# EAGLE design Aux_Power_Board (EAGLE 9.0.1)

## Sheet 1 of 3
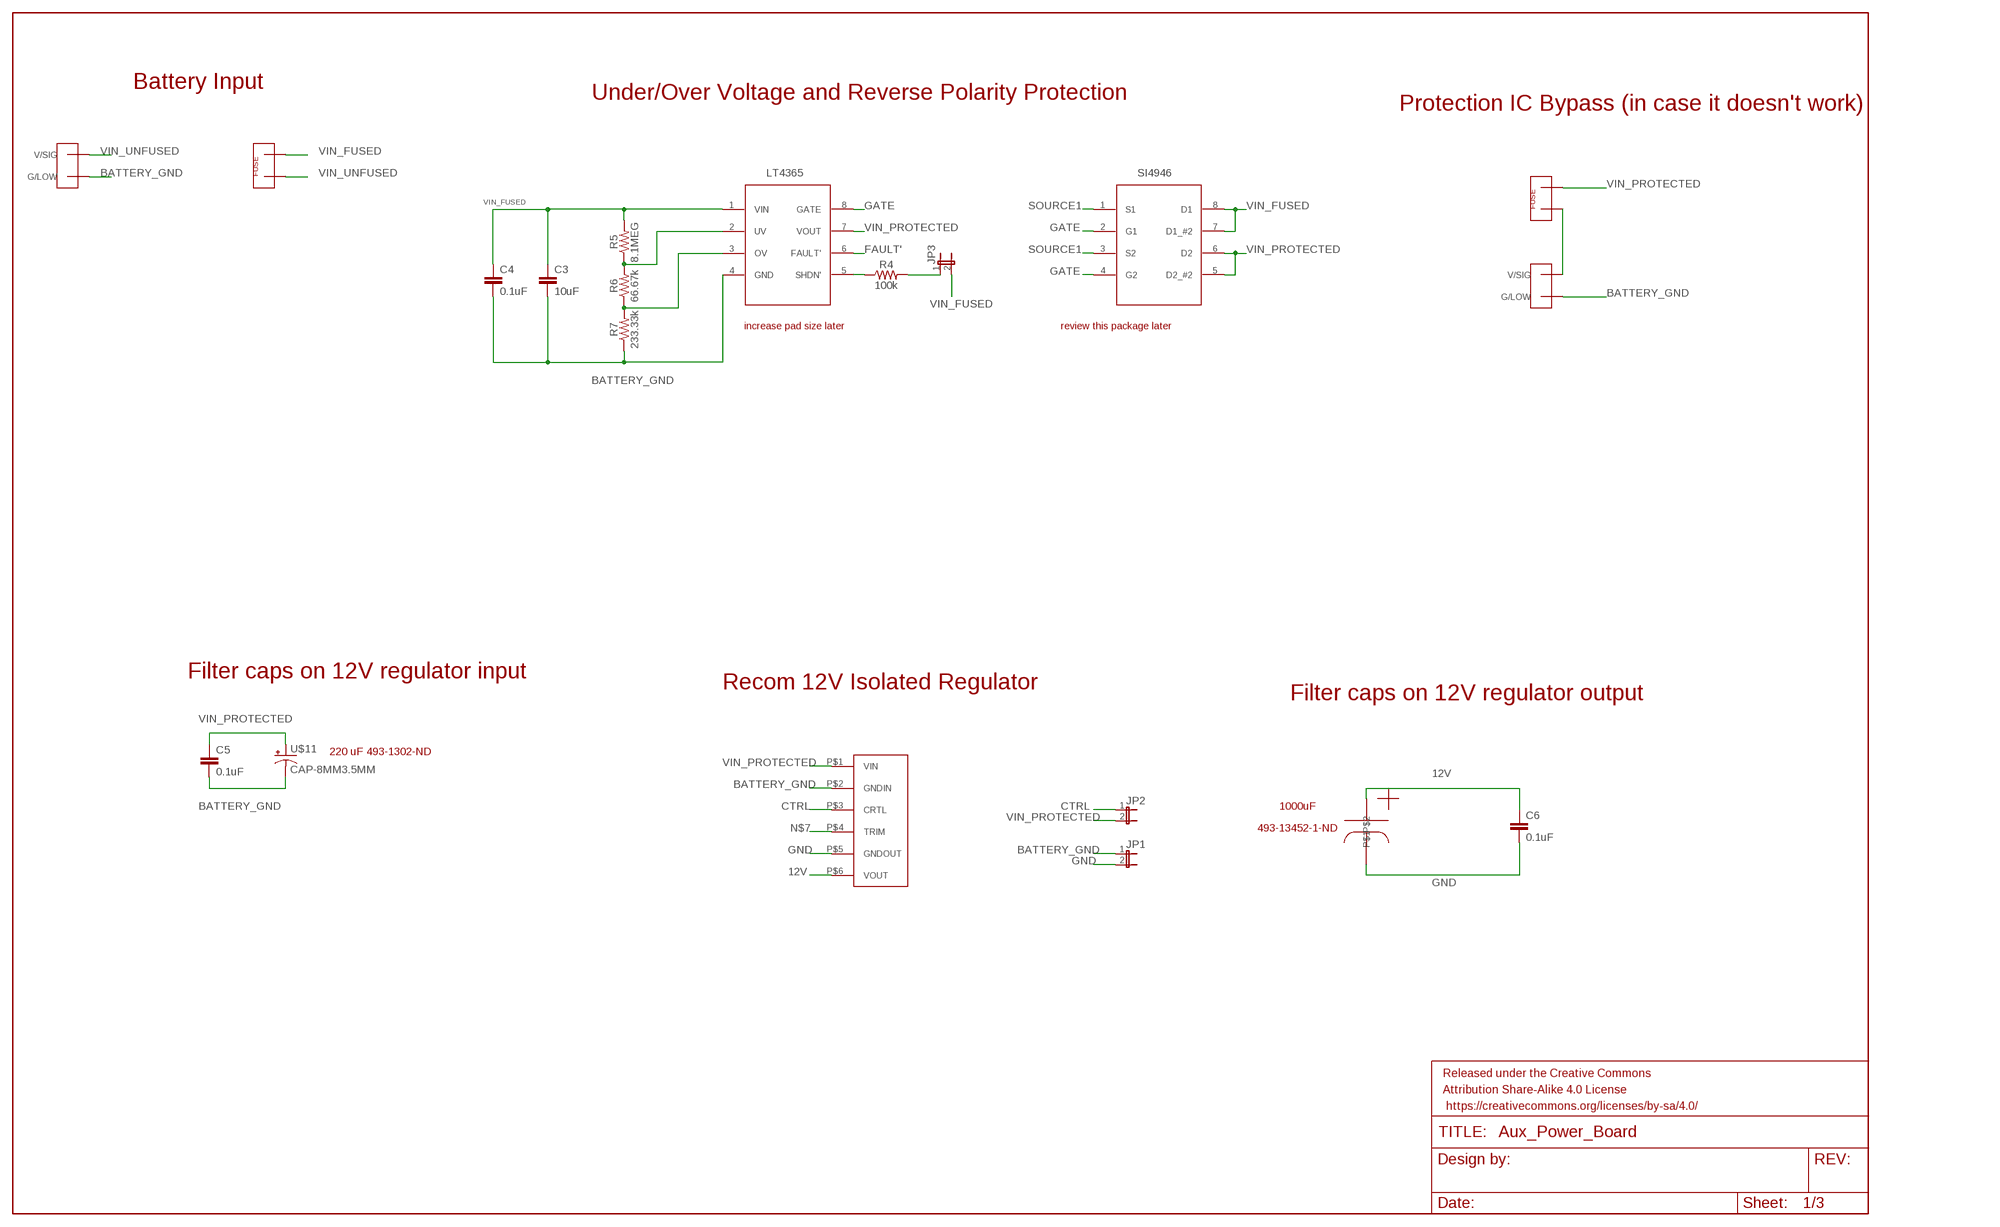
[diagram p0: schematic, sheet 1]

### Parts
C3  10uF  1.0UF-0805-25V-10%  [0805]
C4  0.1uF  1.0UF-0805-25V-10%  [0805]
C5  0.1uF  1.0UF-0805-25V-10%  [0805]
C6  0.1uF  1.0UF-0805-25V-10%  [0805]
FRAME2  FRAME-LEDGER  [CREATIVE_COMMONS]
JP1  JP1E  [JP1]
JP2  JP1E  [JP1]
JP3  JP1E  [JP1]
R4  100k  0.22OHM-0805-1/4W-1%  [0805]
R5  8.1MEG  0.22OHM-0805-1/4W-1%  [0805]
R6  66.67k  0.22OHM-0805-1/4W-1%  [0805]
R7  233.33k  0.22OHM-0805-1/4W-1%  [0805]
U$5  LT4365  [TSOT-23_TS8]
U$6  SI4946  [SOIC127P600X175-8N]
U$11  CAP-8MM3.5MM  [CAP-8MM*3.5MM]
U$12  RPA60-2412SFW_P  [RPA60-2412SFW/P]
U$13  FUSEMINI-BLADE  [MINI-BLADE-FUSE]
U$14  TE770966  [2X1-MATE-N-LOCK]
U$20  FUSEMINI-BLADE  [MINI-BLADE-FUSE]
U$21  TE770966  [2X1-MATE-N-LOCK]
U$22  CAPESK108M025AH4EA  [ESK108M025AH4EA]

### Nets
12V: C6.1 U$12.P$6(VOUT) U$22.P$1 ; also sheet 2,3
BATTERY_GND: C3.2 C4.2 C5.2 JP1.1 R7.1 U$5.4(GND) U$11.P$2(-) U$12.P$2(GNDIN) U$14.CIRCUIT2(G/LOW) U$21.CIRCUIT2(G/LOW) ; also sheet 2
CTRL: JP2.1 U$12.P$3(CRTL)
FAULT': U$5.6(FAULT') ; also sheet 2
GATE: U$5.8(GATE) U$6.2(G1) U$6.4(G2)
GND: C6.2 JP1.2 U$12.P$5(GNDOUT) U$22.P$2 ; also sheet 2,3
N$2: R4.1 U$5.5(SHDN')
N$4: R5.1 R6.2 U$5.2(UV)
N$5: R6.1 R7.2 U$5.3(OV)
N$7: U$12.P$4(TRIM)
N$13: JP3.1 R4.2
N$14: U$20.IN U$21.CIRCUIT1(V/SIG)
SOURCE1: U$6.1(S1) U$6.3(S2)
VIN_FUSED: C3.1 C4.1 JP3.2 R5.2 U$5.1(VIN) U$6.7(D1_#2) U$6.8(D1) U$13.OUT ; also sheet 2
VIN_PROTECTED: C5.1 JP2.2 U$5.7(VOUT) U$6.5(D2_#2) U$6.6(D2) U$11.P$1(+) U$12.P$1(VIN) U$20.OUT ; also sheet 3
VIN_UNFUSED: U$13.IN U$14.CIRCUIT1(V/SIG)

### Notes on the sheet
- Battery Input
- Under/Over Voltage and Reverse Polarity Protection
- Protection IC Bypass (in case it doesn't work)
- increase pad size later | review this package later
- Filter caps on 12V regulator input
- Recom 12V Isolated Regulator
- Filter caps on 12V regulator output
- 220 uF 493-1302-ND
- 1000uF
- 493-13452-1-ND

## Sheet 2 of 3
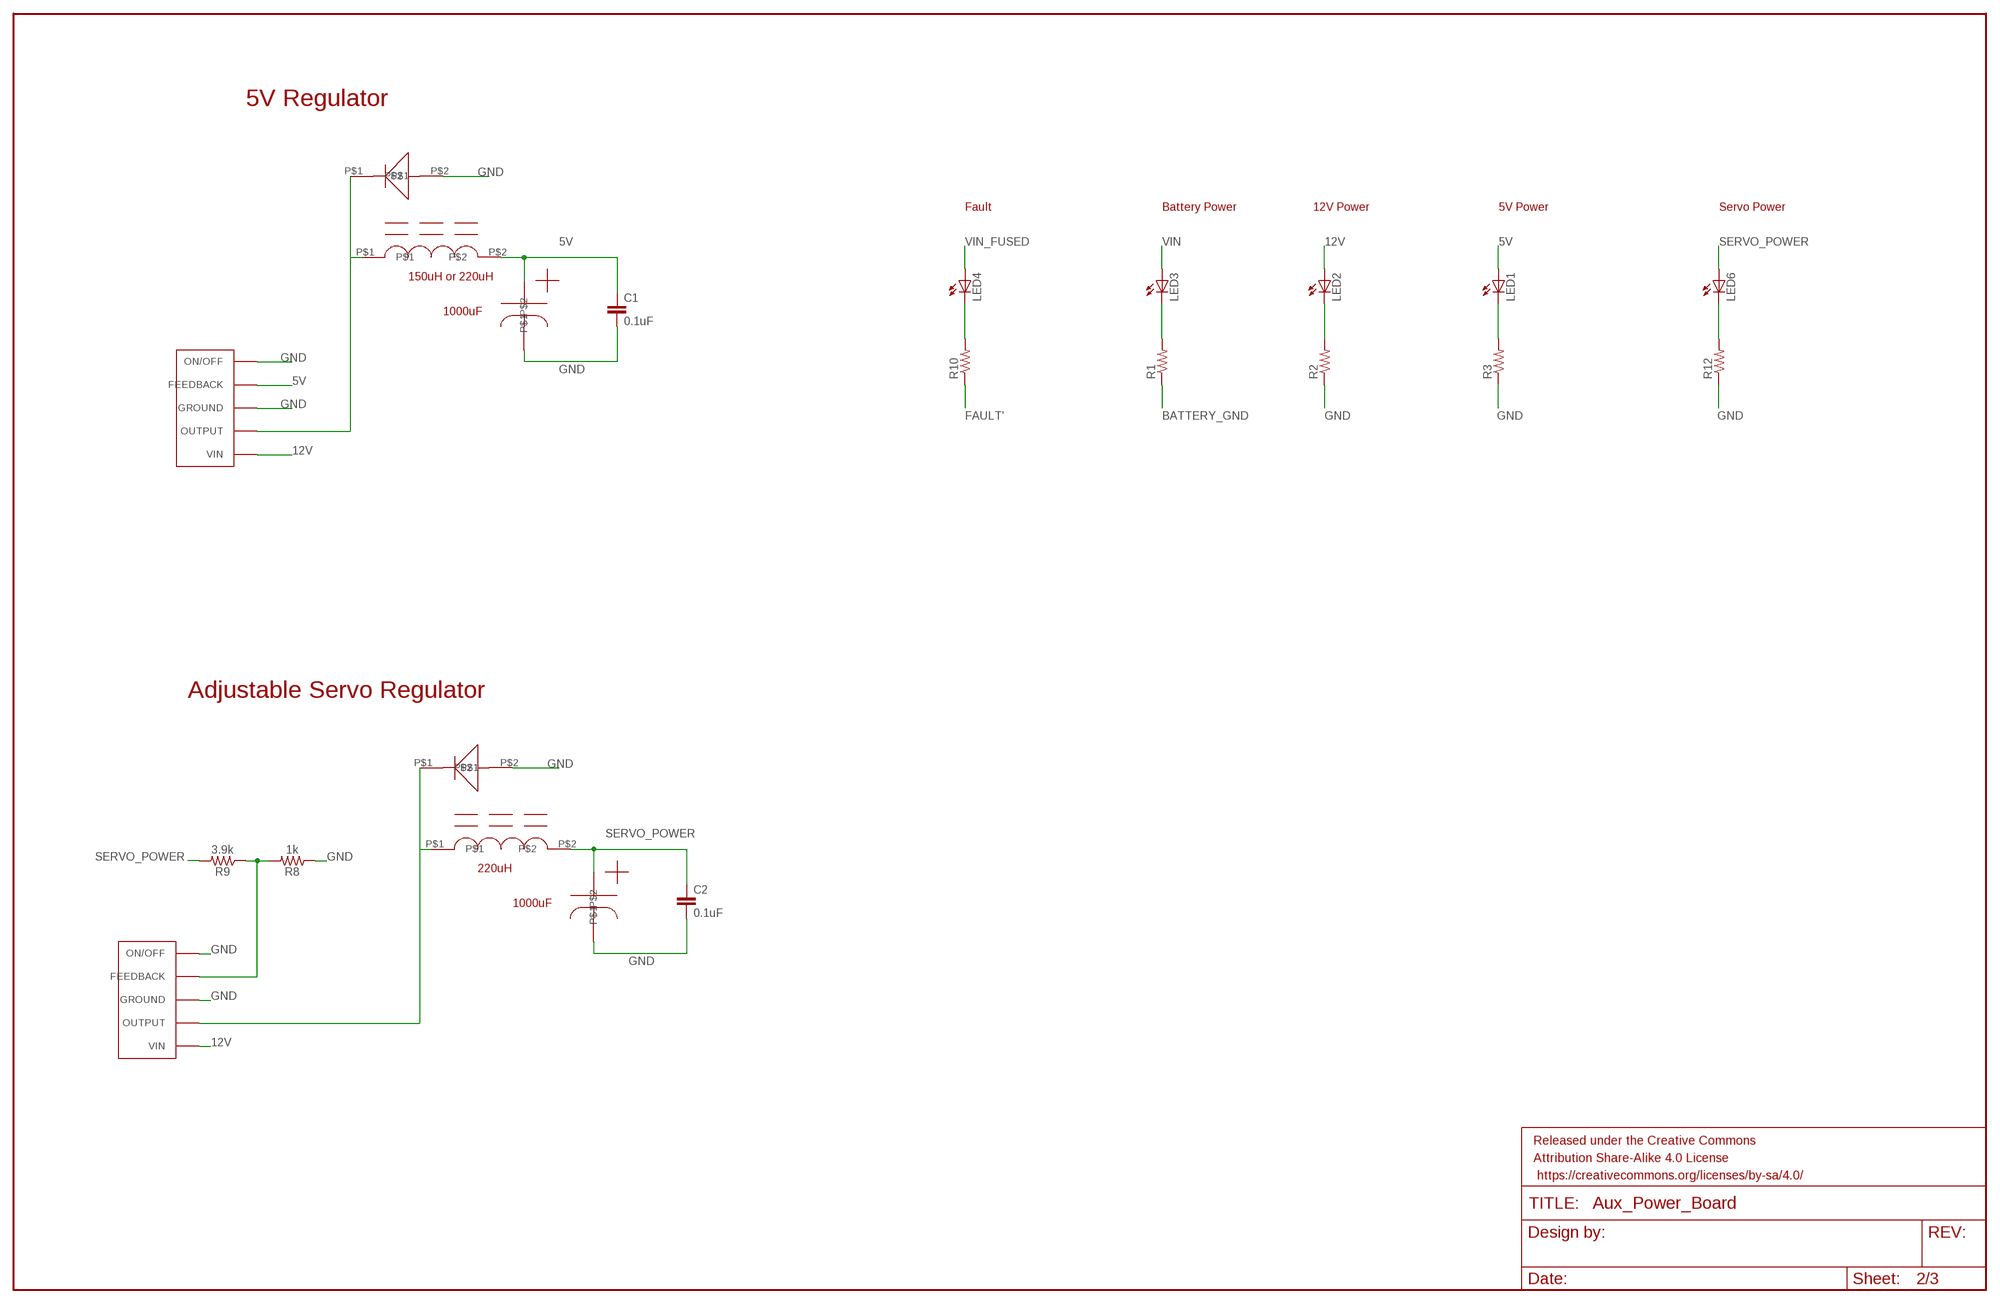
[diagram p1: schematic, sheet 2]

### Parts
C1  0.1uF  1.0UF-0805-25V-10%  [0805]
C2  0.1uF  1.0UF-0805-25V-10%  [0805]
FRAME1  FRAME-LEDGER  [CREATIVE_COMMONS]
LED1  LEDCHIP-LED0805  [CHIP-LED0805]
LED2  LEDCHIP-LED0805  [CHIP-LED0805]
LED3  LEDCHIP-LED0805  [CHIP-LED0805]
LED4  LEDCHIP-LED0805  [CHIP-LED0805]
LED6  LEDCHIP-LED0805  [CHIP-LED0805]
R1  R-US_M0805  [M0805]
R2  R-US_M0805  [M0805]
R3  R-US_M0805  [M0805]
R8  1k  0.22OHM-0805-1/4W-1%  [0805]
R9  3.9k  0.22OHM-0805-1/4W-1%  [0805]
R10  R-US_M0805  [M0805]
R12  R-US_M0805  [M0805]
U$4  MBR360GOS  [MBR360GOS]
U$7  LM2576  [D2PAK-5]
U$8  MBR360GOS  [MBR360GOS]
U$9  CAPESK108M025AH4EA  [ESK108M025AH4EA]
U$10  M1418-ND  [M1418-ND]
U$23  LM2576  [D2PAK-5]
U$24  CAPESK108M025AH4EA  [ESK108M025AH4EA]
U$25  M1418-ND  [M1418-ND]

### Nets
5V: C1.1 LED1.A U$7.4(FEEDBACK) U$9.P$1 U$10.P$2 ; also sheet 3
12V: LED2.A U$7.1(VIN) U$23.1(VIN) ; also sheet 1,3
BATTERY_GND: R1.1 ; also sheet 1
FAULT': R10.1 ; also sheet 1
GND: C1.2 C2.2 R2.1 R3.1 R8.1 R12.1 U$4.P$2 U$7.3(GROUND) U$7.5(ON/OFF) U$7.GROUND U$8.P$2 U$9.P$2 U$23.3(GROUND) U$23.5(ON/OFF) U$23.GROUND U$24.P$2 ; also sheet 1,3
N$1: U$4.P$1 U$7.2(OUTPUT) U$10.P$1
N$3: LED3.C R1.2
N$6: LED2.C R2.2
N$9: LED1.C R3.2
N$15: U$8.P$1 U$23.2(OUTPUT) U$25.P$1
N$16: R8.2 R9.1 U$23.4(FEEDBACK)
N$17: LED4.C R10.2
N$19: LED6.C R12.2
SERVO_POWER: C2.1 LED6.A R9.2 U$24.P$1 U$25.P$2 ; also sheet 3
VIN: LED3.A
VIN_FUSED: LED4.A ; also sheet 1

### Notes on the sheet
- 5V Regulator
- Fault | Battery Power | 12V Power | 5V Power | Servo Power
- 150uH or 220uH
- 1000uF
- Adjustable Servo Regulator
- 220uH
- 1000uF

## Sheet 3 of 3
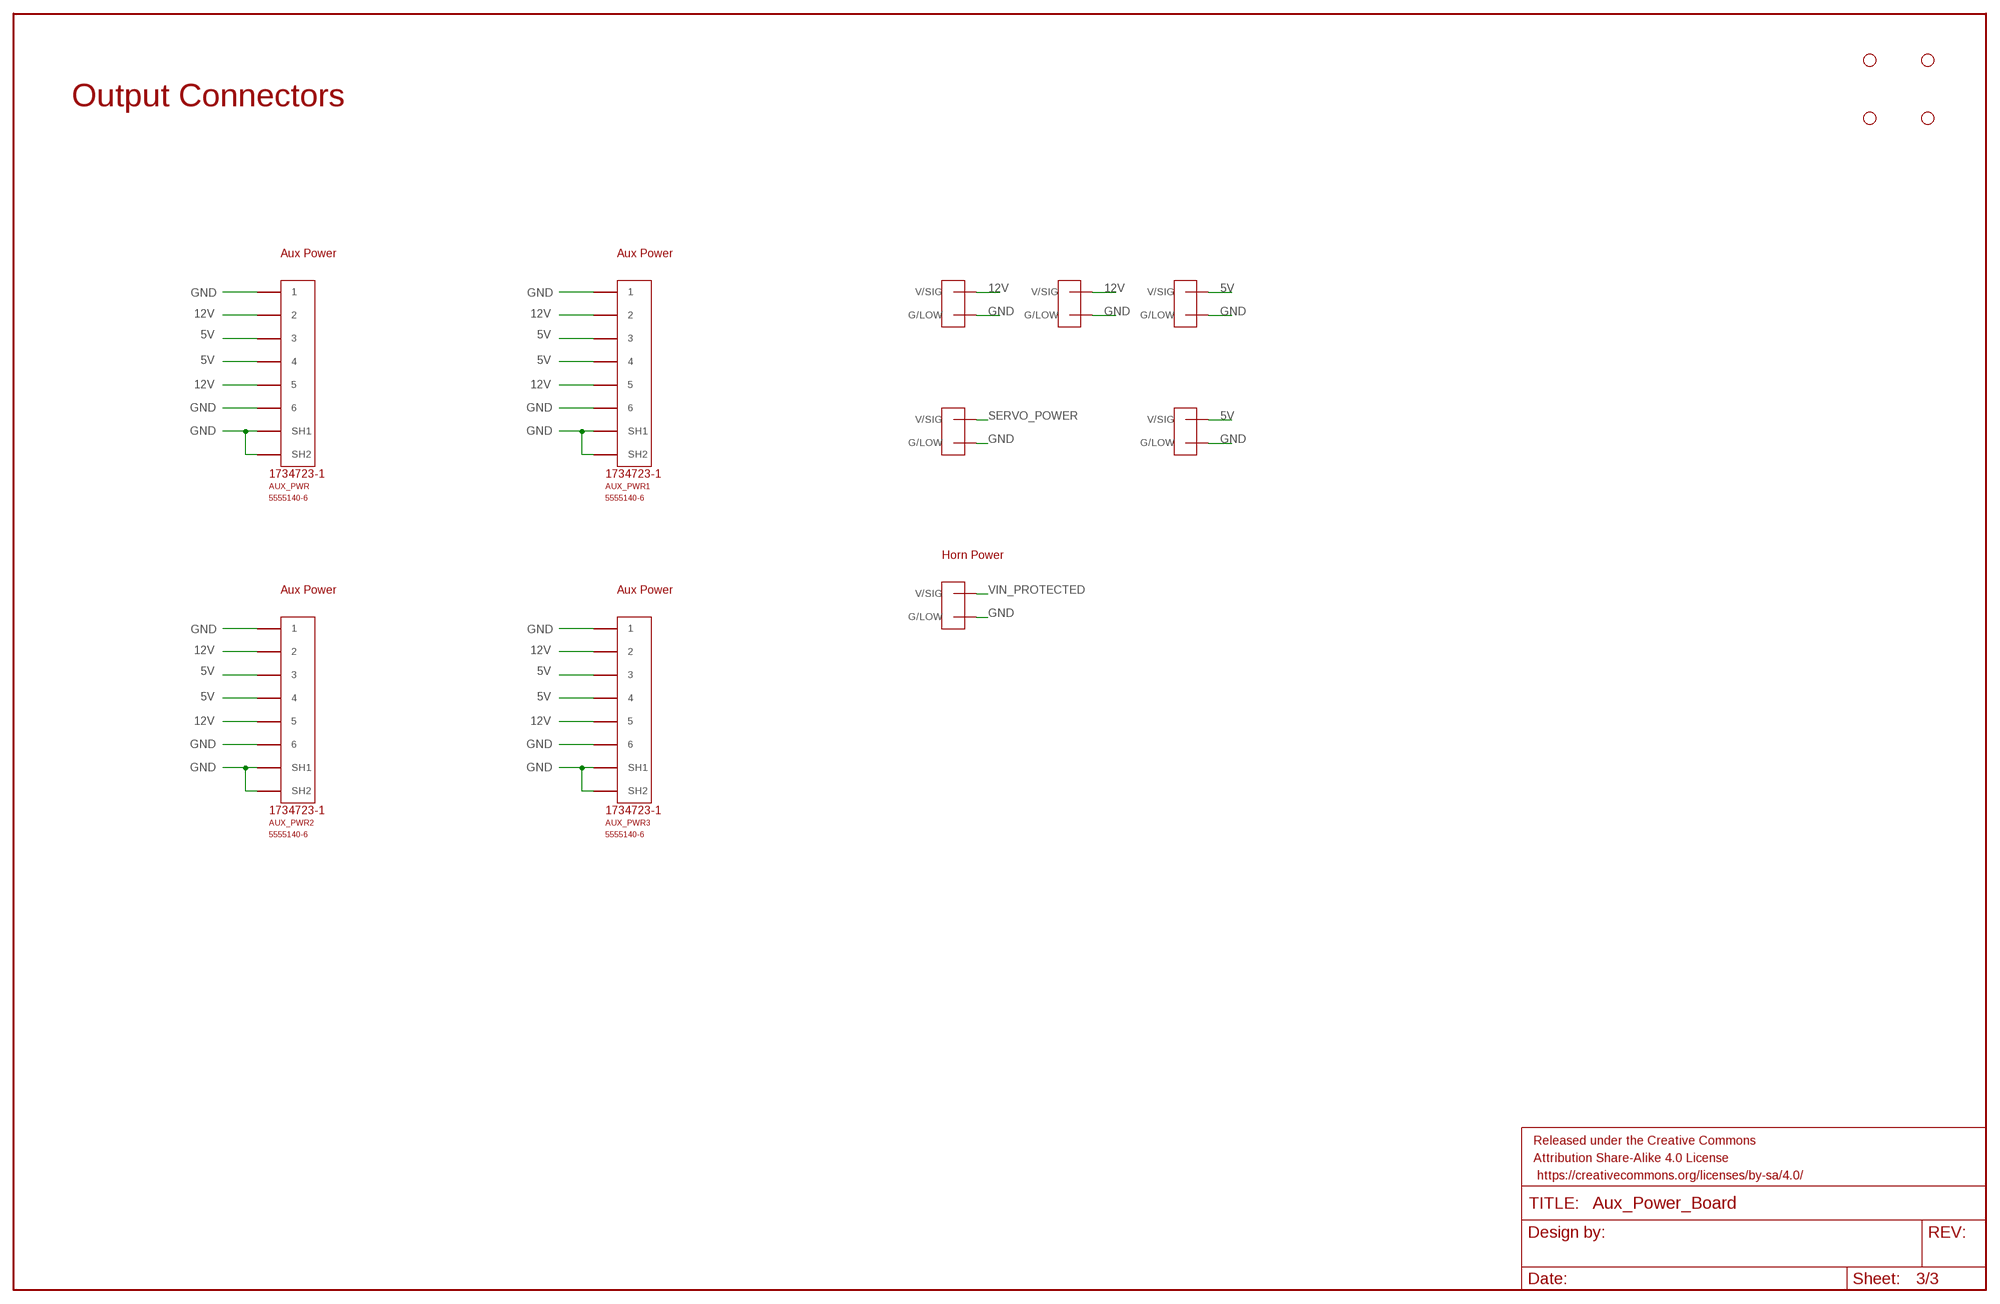
[diagram p2: schematic, sheet 3]

### Parts
AUX_PWR  5555140-6  [1734723-1_RJ11]
AUX_PWR1  5555140-6  [1734723-1_RJ11]
AUX_PWR2  5555140-6  [1734723-1_RJ11]
AUX_PWR3  5555140-6  [1734723-1_RJ11]
FRAME4  FRAME-LEDGER  [CREATIVE_COMMONS]
H1  STAND-OFF  [STAND-OFF]
H2  STAND-OFF  [STAND-OFF]
H3  STAND-OFF  [STAND-OFF]
H4  STAND-OFF  [STAND-OFF]
U$1  TE770966  [2X1-MATE-N-LOCK]
U$2  TE770966  [2X1-MATE-N-LOCK]
U$3  TE770966  [2X1-MATE-N-LOCK]
U$15  TE770966  [2X1-MATE-N-LOCK]
U$26  TE770966  [2X1-MATE-N-LOCK]
U$27  TE770966  [2X1-MATE-N-LOCK]

### Nets
5V: AUX_PWR1.3 AUX_PWR1.4 AUX_PWR2.3 AUX_PWR2.4 AUX_PWR3.3 AUX_PWR3.4 AUX_PWR.3 AUX_PWR.4 U$3.CIRCUIT1(V/SIG) U$27.CIRCUIT1(V/SIG) ; also sheet 2
12V: AUX_PWR1.2 AUX_PWR1.5 AUX_PWR2.2 AUX_PWR2.5 AUX_PWR3.2 AUX_PWR3.5 AUX_PWR.2 AUX_PWR.5 U$1.CIRCUIT1(V/SIG) U$2.CIRCUIT1(V/SIG) ; also sheet 1,2
GND: AUX_PWR1.1 AUX_PWR1.6 AUX_PWR1.SH1 AUX_PWR1.SH2 AUX_PWR2.1 AUX_PWR2.6 AUX_PWR2.SH1 AUX_PWR2.SH2 AUX_PWR3.1 AUX_PWR3.6 AUX_PWR3.SH1 AUX_PWR3.SH2 AUX_PWR.1 AUX_PWR.6 AUX_PWR.SH1 AUX_PWR.SH2 U$1.CIRCUIT2(G/LOW) U$2.CIRCUIT2(G/LOW) U$3.CIRCUIT2(G/LOW) U$15.CIRCUIT2(G/LOW) U$26.CIRCUIT2(G/LOW) U$27.CIRCUIT2(G/LOW) ; also sheet 1,2
SERVO_POWER: U$26.CIRCUIT1(V/SIG) ; also sheet 2
VIN_PROTECTED: U$15.CIRCUIT1(V/SIG) ; also sheet 1

### Notes on the sheet
- Output Connectors
- Aux Power | Aux Power
- Horn Power
- Aux Power | Aux Power

## Library data of the parts
AUX_PWR AUX_PWR1-AUX_PWR3 = 5555140-6 RJ11:5555140-6
C1-C6 = SparkFun-Capacitors:1.0UF: 1µF ceramic capacitors A capacitor is a passive two-terminal electrical component used to store electrical energy temporarily in an electric field.; PROD_ID: CAP-08064; VALUE: 1.0uF
FRAME1 FRAME2 FRAME4 = SparkFun-Aesthetics:FRAME-LEDGER: Schematic Frame - Ledger Standard 11x14 US Ledger frame
H1-H4 = SparkFun-Electromechanical:STAND-OFF: #4 Stand Off This is the mechanical footprint for a #4 phillips button head screw. Use the keepout ring to avoid running the screw head into surrounding components. SKU : PRT-00447
JP1-JP3 = jumper:JP1E: JUMPER
LED1-LED4 LED6 = led:LED: LED OSRAM: - CHIPLED LG R971, LG N971, LY N971, LG Q971, LY Q971, LO R971, LY R971 LH N974, LH R974 LS Q976, LO Q976, LY Q976 LO Q996 - Hyper CHIPLED LW Q18S LB Q993, LB Q99A, LB R99A - SideLED LS A670, LO A670, LY A670, LG A670, LP A670 LB A673, LV A673, LT A673, LW A673 LH A674 LY A675 LS A676, LA A676, LO A676, LY A676, LW A676 LS A679, LY A679, LG A679 - Hyper Micro SIDELED® LS Y876, LA Y876, LO Y876, LY Y876 LT Y87S - SmartLED LW L88C, LW L88S LB L89C, LB L89S, LG L890 LS L89K, LO L89K, LY L89K LS L896, LA L896, LO L896, LY L896 - TOPLED LS T670, LO T670, LY T670, LG T670, LP T670 LSG T670, LSP T670, LSY T670, LOP T670, LYG T670 LG T671, LOG T671, LSG T671 LB T673, LV T673, LT T673, LW T673 LH T674 LS T676, LA T676, LO T676, LY T676, LB T676, LH T676, LSB T676, LW T676 LB T67C, LV T67C, LT T67C, LS T67K, LO T67K, LY T67K, LW E67C LS E67B, LA E67B, LO E67B, LY E67B, LB E67C, LV E67C, LT E67C LW T67C LS T679, LY T679, LG T679 LS T770, LO T770, LY T770, LG T770, LP T770 LB T773, LV T773, LT T773, LW T773 LH T774 LS E675, LA E675, LY E675, LS T675 LS T776, LA T776, LO T776, LY T776, LB T776 LHGB T686 LT T68C, LB T68C - Hyper Mini TOPLED® LB M676 - Mini TOPLED Santana® LG M470 LS M47K, LO M47K, LY M47K Source: http://www.osram.convergy.de LUXEON: - LUMILED® LXK2-PW12-R00, LXK2-PW12-S00, LXK2-PW14-U00, LXK2-PW14-V00 LXK2-PM12-R00, LXK2-PM12-S00, LXK2-PM14-U00 LXK2-PE12-Q00, LXK2-PE12-R00, LXK2-PE12-S00, LXK2-PE14-T00, LXK2-PE14-U00 LXK2-PB12-K00, LXK2-PB12-L00, LXK2-PB12-M00, LXK2-PB14-N00, LXK2-PB14-P00, LXK2-PB14-Q00 LXK2-PR12-L00, LXK2-PR12-M00, LXK2-PR14-Q00, LXK2-PR14-R00 LXK2-PD12-Q00, LXK2-PD12-R00, LXK2-PD12-S00 LXK2-PH12-R00, LXK2-PH12-S00 LXK2-PL12-P00, LXK2-PL12-Q00, LXK2-PL12-R00 Source: www.luxeon.com KINGBRIGHT: KA-3528ASYC Source: www.kingbright.com
R1-R3 R10 R12 = rcl:R-US_: RESISTOR, American symbol; SPICEPREFIX: R
R4-R9 = SparkFun-Resistors:0.22OHM: 0.22Ω resistor A resistor is a passive two-terminal electrical component that implements electrical resistance as a circuit element. Resistors act to reduce current flow, and, at the same time, act to lower voltage levels within circuits. - Wikipedia; PROD_ID: RES-09883; VALUE: 0.22
U$1-U$3 U$14 U$15 U$21 U$26 U$27 = Shell2013(1):TE770966
U$4 U$8 = Shell2013:MBR360GOS
U$5 = Eagle Library:LT4365
U$6 = Eagle Library:SI4946
U$7 U$23 = Shell2015:LM2576
U$9 U$22 U$24 = Shell2015:CAP
U$10 U$25 = Shell2015:M1418-ND: 100uF inductor
U$11 = Eagle Library:CAP-8MM*3.5MM
U$12 = RPA60-2412SFW_P:RPA60-2412SFW_P
U$13 U$20 = Shell2013:FUSE

## Board
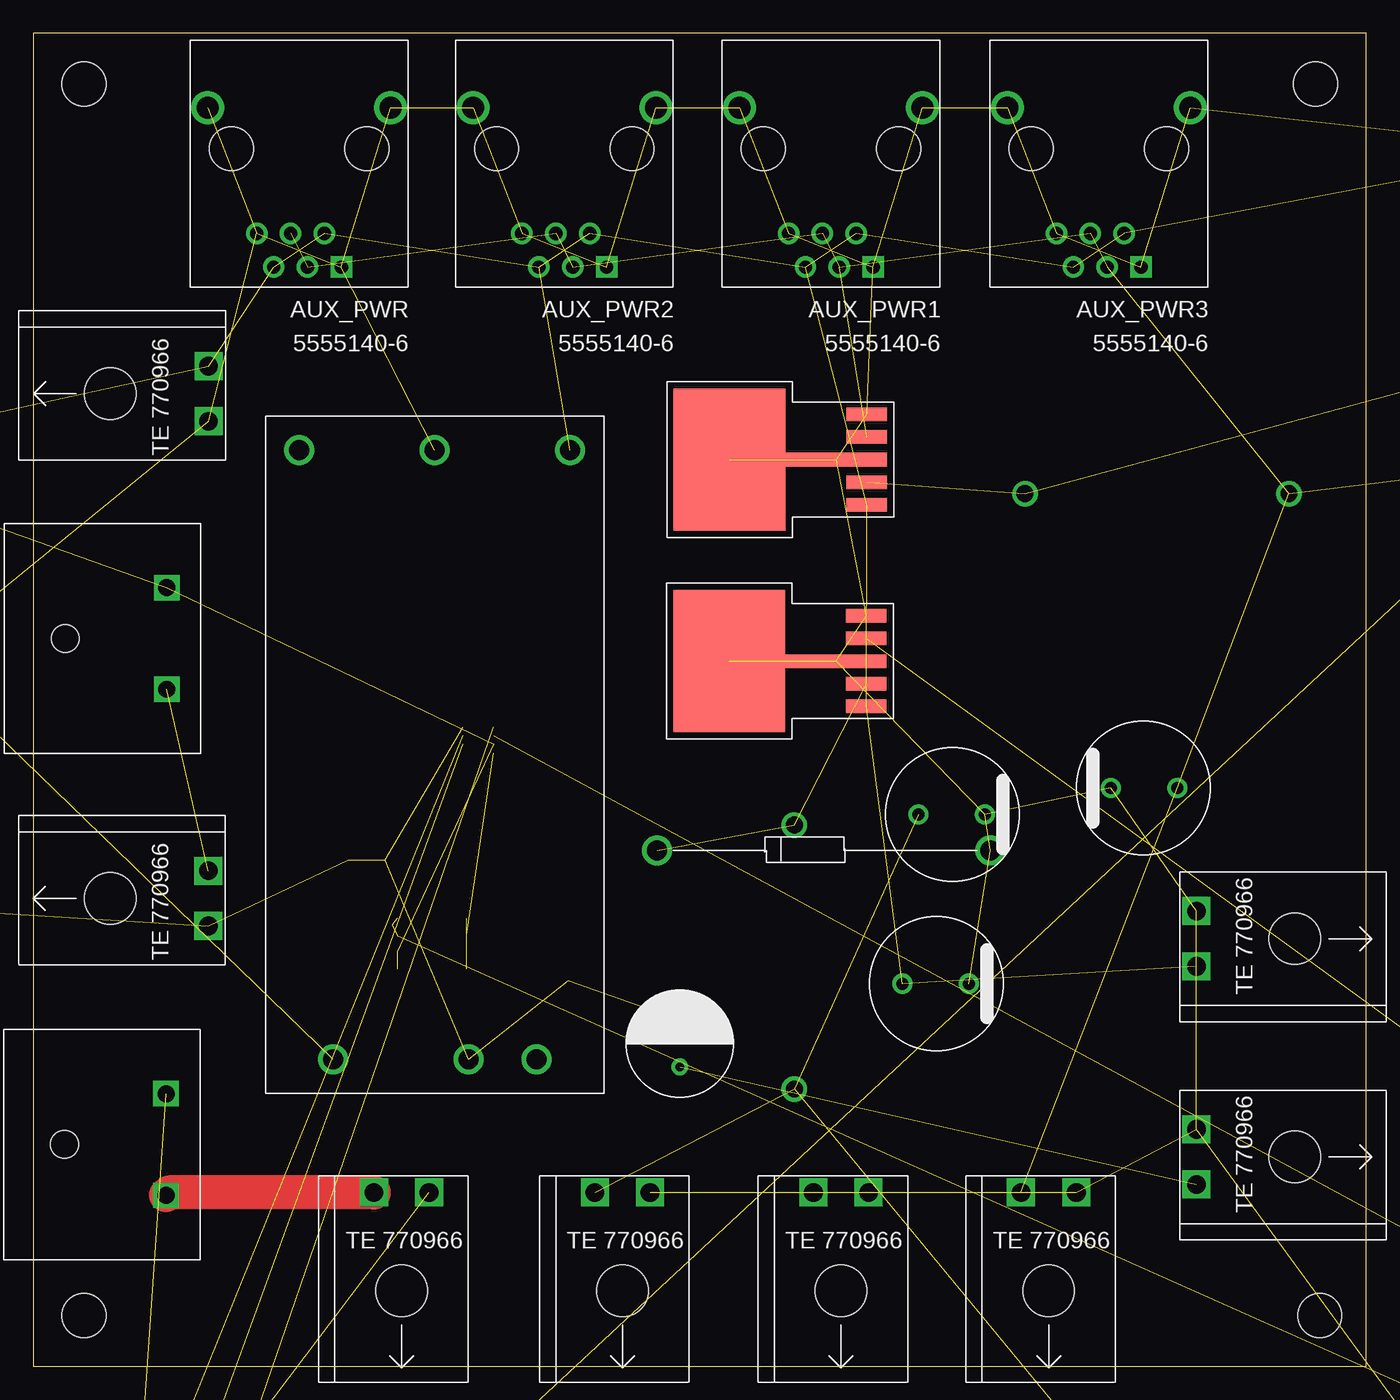
[diagram p3: board, top side]
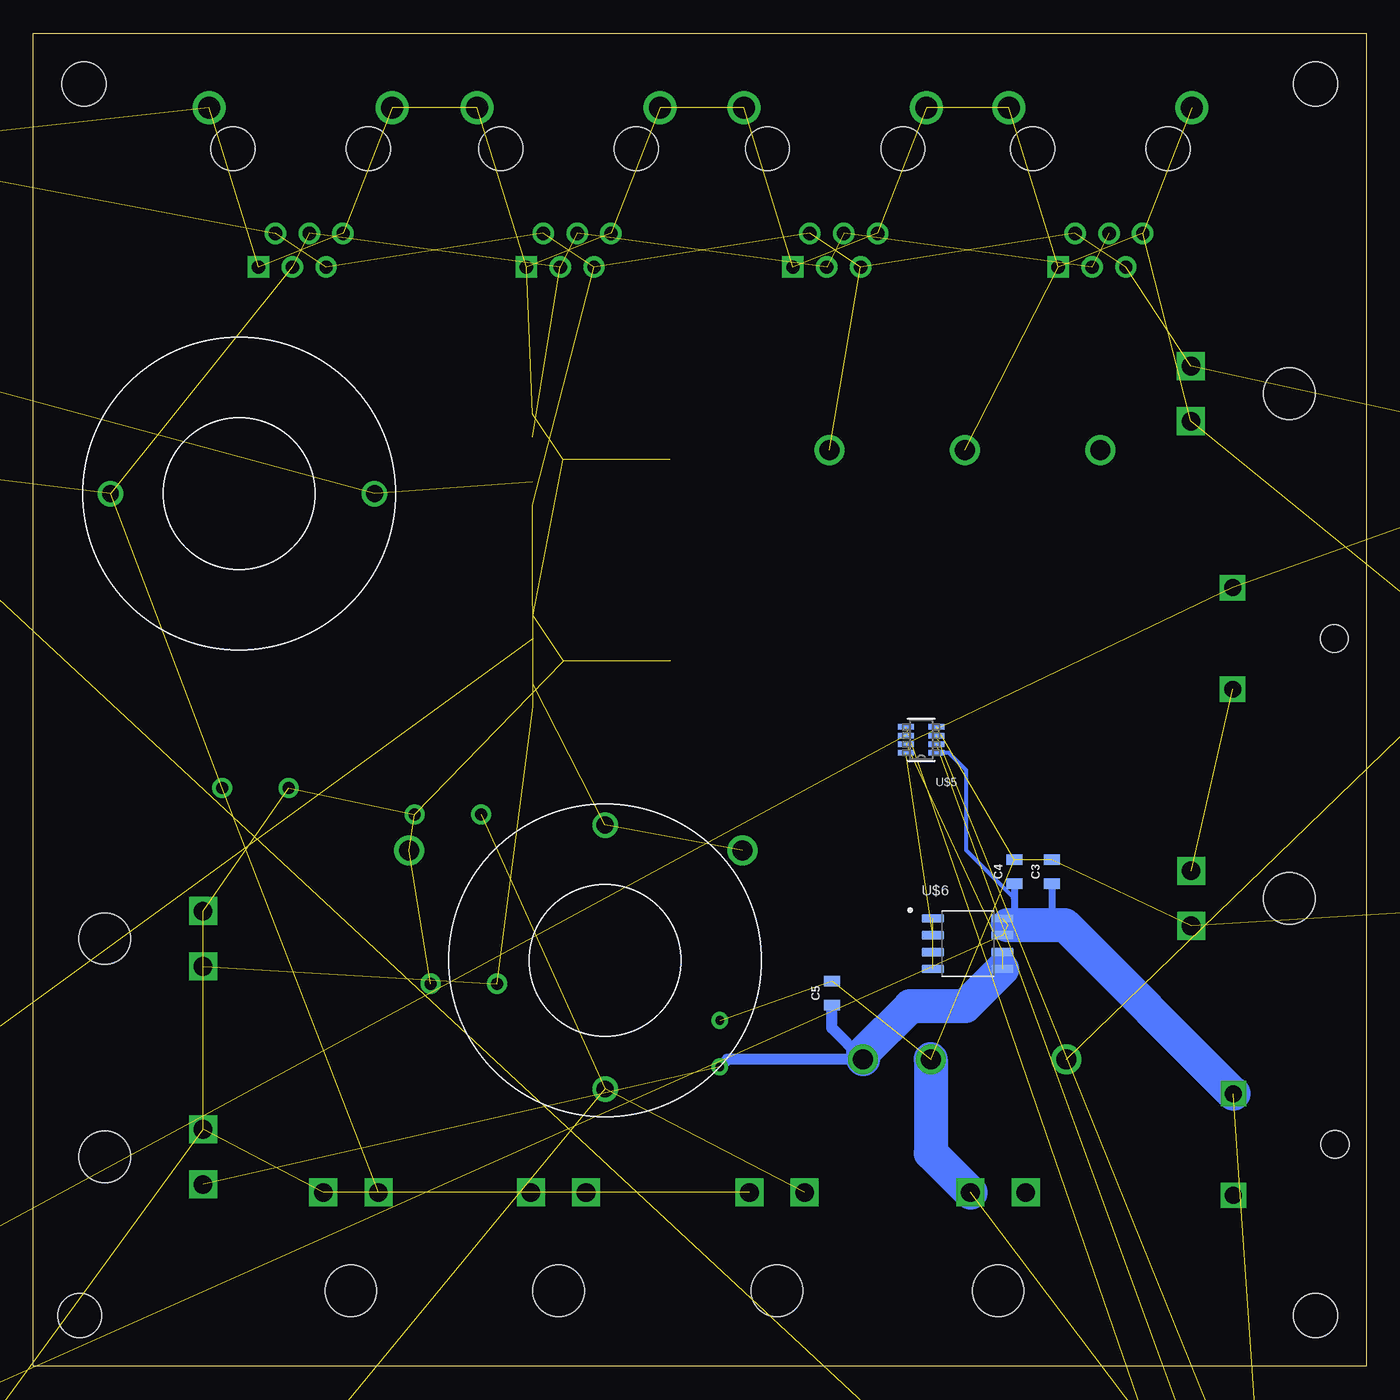
[diagram p4: board, bottom side, seen from below]

Size 100 x 100 mm. Coordinates in mm from the lower left corner, seen from the top.
Outline: 0,0 100,0 100,100 0,100 0,0
Copper layers (1*16): Top 0.035mm / dielectric 1.5mm / Bottom 0.035mm
Design rules "SparkFun *": minimum track width 8mil, minimum drill 20mil, track to track 16mil, track to pad 16mil, pad to pad 16mil, via to via 16mil, smd to smd 16mil, copper to edge 10mil, drill to drill 8mil, minimum pad ring 12mil, minimum via ring 10mil, stop-mask expansion 4mil, vias tented up to drill 25mil, thermal gap 10mil

### Footprints (pad centres in the part's own frame; a part is rotated, then mirrored left to right if it is on the bottom)
1734723-1_RJ11 = drill 1 square: 1 -3.81,2.54 | drill 1: 2 -2.54,0; 3 -1.27,2.54; 4 0,0; 5 1.27,2.54; 6 2.54,0 | drill 1.65: SH1 -7.5,-9.4; SH2 6.22,-9.4 | hole 3.3: -5.72,-6.35; 4.44,-6.35
0805 = smd 0.8 x 1.2: 1 -0.9,0; 2 0.9,0
STAND-OFF = hole 3.302: 0,0
JP1 = drill 0.914 long: 1 0,-1.27; 2 0,1.27
CHIP-LED0805 = smd 1.2 x 1.2: A 0,-1.05; C 0,1.05
M0805 = smd 1.3 x 1.6: 1 -0.95,0; 2 0.95,0
2X1-MATE-N-LOCK = drill 1.4 square: CIRCUIT1 -2.07,14.23; CIRCUIT2 2.07,14.23 | hole 3.86: 0,6.86
MBR360GOS = drill 1.5: P$1 0,0; P$2 25,0
TSOT-23_TS8 = smd 1.219 x 0.406: 1 -1.143,0.975; 2 -1.143,0.325; 3 -1.143,-0.325; 4 -1.143,-0.975; 5 1.143,-0.975; 6 1.143,-0.325; 7 1.143,0.325; 8 1.143,0.975
SOIC127P600X175-8N = smd 1.71 x 0.61: 1 -2.605,1.905; 2 -2.605,0.635; 3 -2.605,-0.635; 4 -2.605,-1.905; 5 2.605,-1.905; 6 2.605,-0.635; 7 2.605,0.635; 8 2.605,1.905
D2PAK-5 = smd 3.048 x 1.016: 1 6.096,-3.404; 2 6.096,-1.702; 4 6.096,1.702; 5 6.096,3.404 | smd 7.62 x 1.016: 3 3.81,0 | smd 8.382 x 10.668: GROUND -4.191,0
ESK108M025AH4EA = drill 0.9: P$1 0,0; P$2 5,0
M1418-ND = drill 1.27: P$1 0,0; P$2 19.812,0
CAP-8MM*3.5MM = drill 0.65: P$1 -1.75,0; P$2 1.75,0
RPA60-2412SFW/P = drill 1.5: P$1 0,0; P$2 0,5.08; P$3 0,15.24; P$4 45.72,17.78; P$5 45.72,7.62; P$6 45.72,-2.54
MINI-BLADE-FUSE = drill 1.27 square: IN 3.81,7.62; OUT -3.81,7.62 | hole 2.083: 0,0

### Placement (x,y rotation side)
AUX_PWR  19.3,85 180 top
AUX_PWR1  59.2,85 180 top
AUX_PWR2  39.2,85 180 top
AUX_PWR3  79.3,85 180 top
C1  160.9,87 0 top  (outside the outline)
C2  181.1,1.2 0 top  (outside the outline)
C3  23.6,37.1 90 bottom
C4  26.4,37.1 90 bottom
C5  40.1,28 90 bottom
C6  160.9,99.8 0 top  (outside the outline)
FRAME1  19.05,-14.61 0 top  (outside the outline)
FRAME2  19.05,-23.5 0 top  (outside the outline)
FRAME4  176.9,-34.9 0 top  (outside the outline)
H1  3.81,3.81 0 top
H2  3.81,96.19 0 top
H3  96.52,3.81 0 top
H4  96.19,96.19 0 top
JP1  -27.24,36.76 0 top  (outside the outline)
JP2  -30.97,73.5 90 top  (outside the outline)
JP3  170.3,121.8 0 top  (outside the outline)
LED1  138.59,71.95 0 top  (outside the outline)
LED2  -21.44,67.22 270 top  (outside the outline)
LED3  -28.92,67.47 0 top  (outside the outline)
LED4  159.1,-25.4 0 top  (outside the outline)
LED6  103,-33.8 0 top  (outside the outline)
R1  -20.31,77.55 180 top  (outside the outline)
R2  -65.16,43.82 180 top  (outside the outline)
R3  122.7,90.32 180 top  (outside the outline)
R4  9,-28.6 0 top  (outside the outline)
R5  5.7,-28.6 0 top  (outside the outline)
R6  2.4,-28.6 0 top  (outside the outline)
R7  -0.9,-28.6 0 top  (outside the outline)
R8  161.1,-13.9 0 top  (outside the outline)
R9  157.6,-13.9 0 top  (outside the outline)
R10  158,-19 0 top  (outside the outline)
R12  128.8,-37.8 0 top  (outside the outline)
U$1  101.5,32.07 90 top
U$2  -1.08,72.97 270 top
U$3  76.18,-1.2 0 top
U$4  141.66,83.66 90 top  (outside the outline)
U$5  33.38,46.99 180 bottom
U$6  29.9,31.7 0 bottom
U$7  56.43,68.02 0 top
U$8  46.8,38.7 0 top
U$9  85.83,43.37 180 top
U$10  74.4,65.46 180 bottom
U$11  48.5,24.2 90 top
U$12  37.74,23.02 90 top
U$13  2.34,16.63 270 top
U$14  27.62,-1.2 0 top
U$15  101.5,15.7 90 top
U$20  2.4,54.6 270 top
U$21  -1.1,35.1 270 top
U$22  65.2,28.7 0 top
U$23  56.4,52.9 0 top
U$24  66.4,41.4 0 top
U$25  57.1,40.6 270 bottom
U$26  44.2,-1.2 0 top
U$27  60.6,-1.2 0 top

### Tracks (layer width: path | path; a pad name or v marks a point on that pad's centre or on a via)
5V  (14 unrouted)
12V  (15 unrouted)
BATTERY_GND  (9 unrouted)
  Bottom 2.54: U$12.P$2 32.66,16 U$14.CIRCUIT2
CTRL  (1 unrouted)
FAULT'  (1 unrouted)
GATE  (2 unrouted)
GND  (41 unrouted)
N$1  (2 unrouted)
N$2  (1 unrouted)
N$3  (1 unrouted)
N$4  (2 unrouted)
N$5  (2 unrouted)
N$6  (1 unrouted)
N$9  (1 unrouted)
N$13  (1 unrouted)
N$14  (1 unrouted)
N$15  (2 unrouted)
N$16  (2 unrouted)
N$17  (1 unrouted)
N$19  (1 unrouted)
SERVO_POWER  (5 unrouted)
SOURCE1  (1 unrouted)
VIN_FUSED  (5 unrouted)
  Bottom 0.3: 26.4,35.1 30,38.7 30,44.7 31.32,46.02 U$5.1
  Bottom 0.508: C3.1 23.6,34.08 22.62,33.1 | C4.1 26.4,35.1 26.4,33.6 26.9,33.1
  Bottom 2.54: U$13.OUT 22.62,33.1 26.9,33.1
VIN_PROTECTED  (5 unrouted)
  Bottom 0.813: U$11.P$1 47.93,23.02 U$12.P$1 40.1,25.38 C5.1
  Bottom 2.54: U$6.5 30.09,27 34.2,27 37.74,23.46 U$12.P$1
VIN_UNFUSED
  Top 2.54: U$14.CIRCUIT1 10.17,13.03 U$13.IN